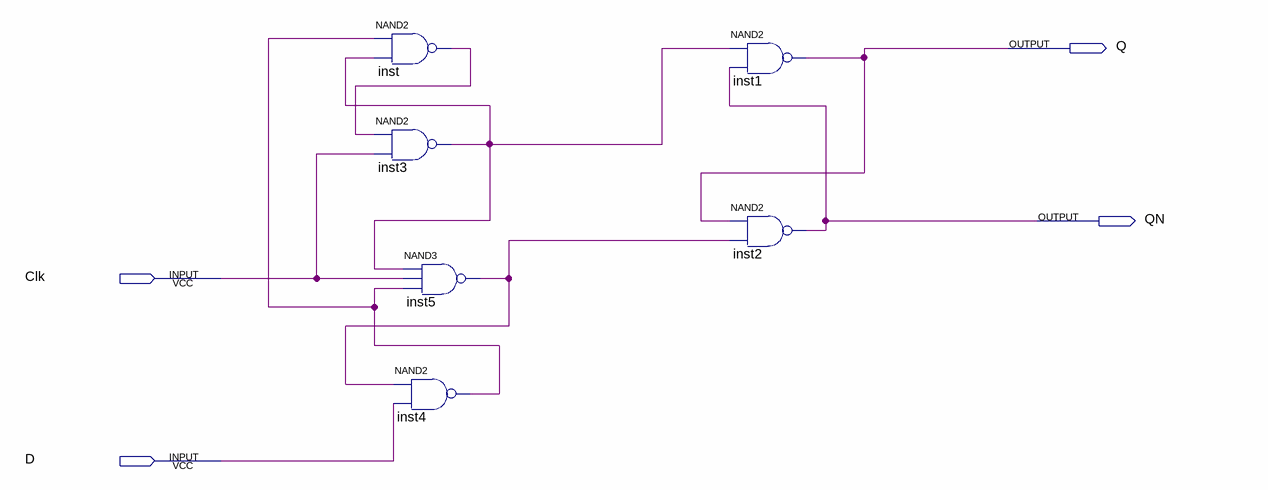
[diagram p0: schematic sheet]
// Quartus schematic dff.bdf as structural Verilog: 6 symbols, 4 pins
module dff (
  input  Clk,
  input  D,
  output Q,
  output QN
);

  wire inst3_out, inst4_out, inst5_out, inst_out;

  nand inst (inst_out, inst4_out, inst3_out);
  nand inst3 (inst3_out, inst_out, Clk);
  nand inst5 (inst5_out, inst3_out, Clk, inst4_out);
  nand inst4 (inst4_out, inst5_out, D);
  nand inst1 (Q, inst3_out, QN);
  nand inst2 (QN, Q, inst5_out);
endmodule
